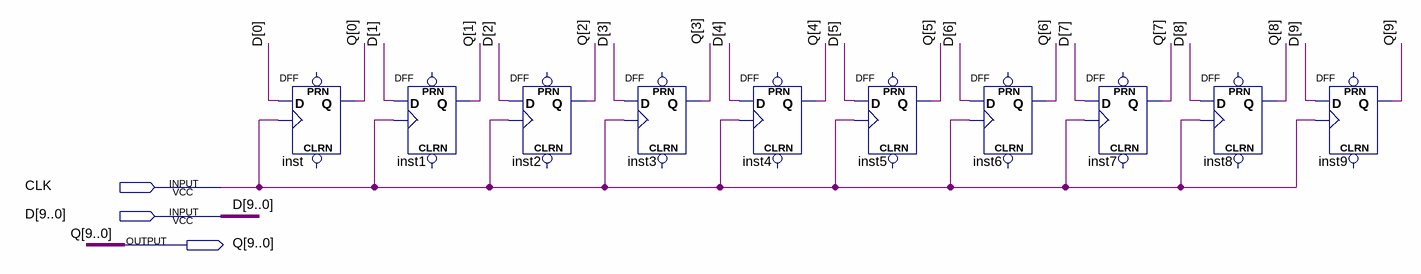
[diagram p0: schematic sheet]
// Quartus schematic ten_d_flip_flop.bdf as structural Verilog: 10 symbols, 3 pins
module ten_d_flip_flop (
  input  CLK,
  input  [9:0] D,
  output [9:0] Q
);

  DFF inst (.CLK(CLK), .D(D[0]), .Q(Q[0]));  // open: CLRN, PRN
  DFF inst1 (.CLK(CLK), .D(D[1]), .Q(Q[1]));  // open: CLRN, PRN
  DFF inst2 (.CLK(CLK), .D(D[2]), .Q(Q[2]));  // open: CLRN, PRN
  DFF inst3 (.CLK(CLK), .D(D[3]), .Q(Q[3]));  // open: CLRN, PRN
  DFF inst4 (.CLK(CLK), .D(D[4]), .Q(Q[4]));  // open: CLRN, PRN
  DFF inst5 (.CLK(CLK), .D(D[5]), .Q(Q[5]));  // open: CLRN, PRN
  DFF inst6 (.CLK(CLK), .D(D[6]), .Q(Q[6]));  // open: CLRN, PRN
  DFF inst7 (.CLK(CLK), .D(D[7]), .Q(Q[7]));  // open: CLRN, PRN
  DFF inst8 (.CLK(CLK), .D(D[8]), .Q(Q[8]));  // open: CLRN, PRN
  DFF inst9 (.CLK(CLK), .D(D[9]), .Q(Q[9]));  // open: CLRN, PRN
endmodule
